# EAGLE design analog-devices (EAGLE 7.6.0)
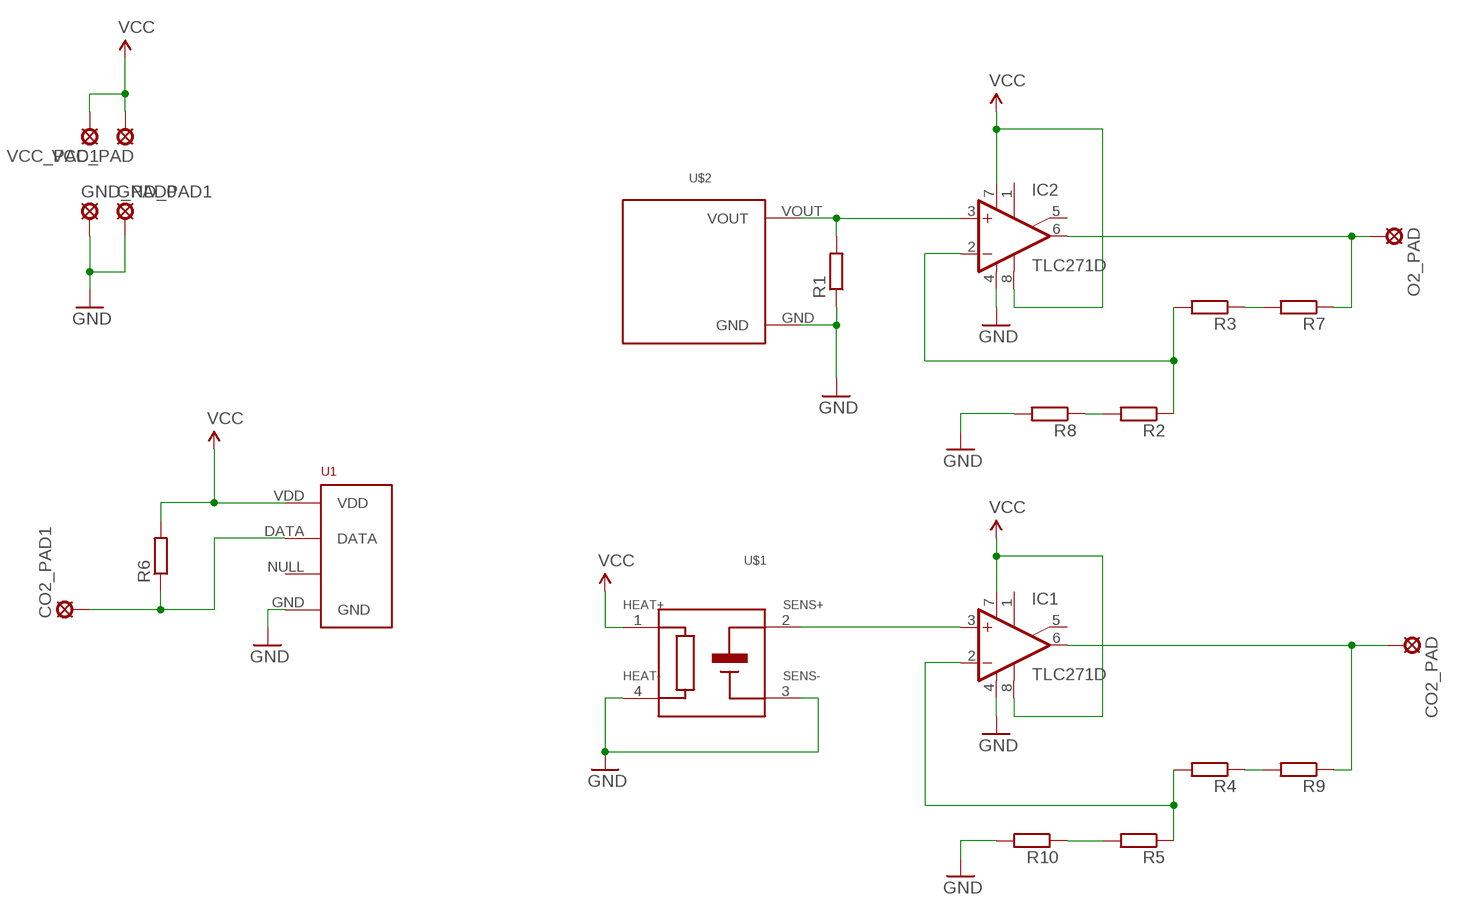
[diagram p0: schematic, sheet 1]

## Parts
CO2_PAD  LSP10  [LSP10]
CO2_PAD1  LSP10  [LSP10]
GND_PAD0  LSP10  [LSP10]
GND_PAD1  LSP10  [LSP10]
IC1  TLC271D  [SO08]
IC2  TLC271D  [SO08]
O2_PAD  LSP10  [LSP10]
R1  R-EU_R0805  [R0805]
R2  R-EU_R0805  [R0805]
R3  R-EU_R0805  [R0805]
R4  R-EU_R0805  [R0805]
R5  R-EU_R0805  [R0805]
R6  R-EU_R0805  [R0805]
R7  R-EU_R0805  [R0805]
R8  R-EU_R0805  [R0805]
R9  R-EU_R0805  [R0805]
R10  R-EU_R0805  [R0805]
U1  RHT03_DHT-22_AM2302RA  [RHT03_DHT-22/RA]
U$1  TGS4161  [TGS4161]
U$2  O2-A2  [O2-A2]
VCC_PAD  LSP10  [LSP10]
VCC_PAD1  LSP10  [LSP10]

## Nets
GND: GND_PAD0.MP GND_PAD1.MP IC1.4(V-) IC2.4(V-) R1.1 R8.2 R10.2 U1.GND U$1.3(SENS-) U$1.4(HEAT-) U$2.GND
N$1: IC2.3(+IN) R1.2 U$2.VOUT
N$2: CO2_PAD1.MP R6.1 U1.DATA
N$3: IC2.2(-IN) R2.1 R3.2
N$4: IC2.6(OUT) O2_PAD.MP R7.1
N$5: IC1.3(+IN) U$1.2(SENS+)
N$6: CO2_PAD.MP IC1.6(OUT) R9.1
N$7: R3.1 R7.2
N$8: R2.2 R8.1
N$10: R4.1 R9.2
N$11: R5.2 R10.1
N$13: IC1.2(-IN) R4.2 R5.1
VCC: IC1.7(V+) IC1.8(OPT) IC2.7(V+) IC2.8(OPT) R6.2 U1.VDD U$1.1(HEAT+) VCC_PAD1.MP VCC_PAD.MP
Unconnected: IC1.1(ON1) IC1.5(ON2) IC2.1(ON1) IC2.5(ON2) U1.NULL

## Library data of the parts
CO2_PAD CO2_PAD1 GND_PAD0 GND_PAD1 O2_PAD VCC_PAD VCC_PAD1 = solpad:LSP10: SOLDER PAD drill 1.0 mm, distributor Buerklin, 12H555
IC1 IC2 = linear:TLC271: OP AMP
R1-R10 = resistor:R-EU_: RESISTOR, European symbol
U1 = RHT03_DHT-22_AM2302:RHT03_DHT-22_AM2302: RHT03 / DHT-22 / AM2302 Packages and symbol for the RHT03 / DHT-22 relative humidity and temperature sensor. Note: The AM2302 is a wired version of the DHT-22 which typically requires less clearance and is thus provided as a separate package.; PROD_ID: SEN-10167
U$1 = datchiki:TGS4161: TGS4161 The Figaro TGS4161 is a new solid electrolyte type sensor which offers miniaturization, low power consumption, and long life. The TGS4161 displays high selectivity to carbon dioxide. Also, the TGS4161 displays good long term stability and shows excellent durability against the effects of high humidity through the application of innovative technology in the sensor’s electrode design. http://www.netzmafia.de/skripten/hardware/Datenblaetter/Gassensoren/TGS4161Dtl.pdf
U$2 = datchiki:O2-A2: O2-A2 Oxy O2-A2 Oxygen Sensor en Sensor http://www.alphasense.com/WEB1213/wp-content/uploads/2015/09/O2A2.pdf

## Board
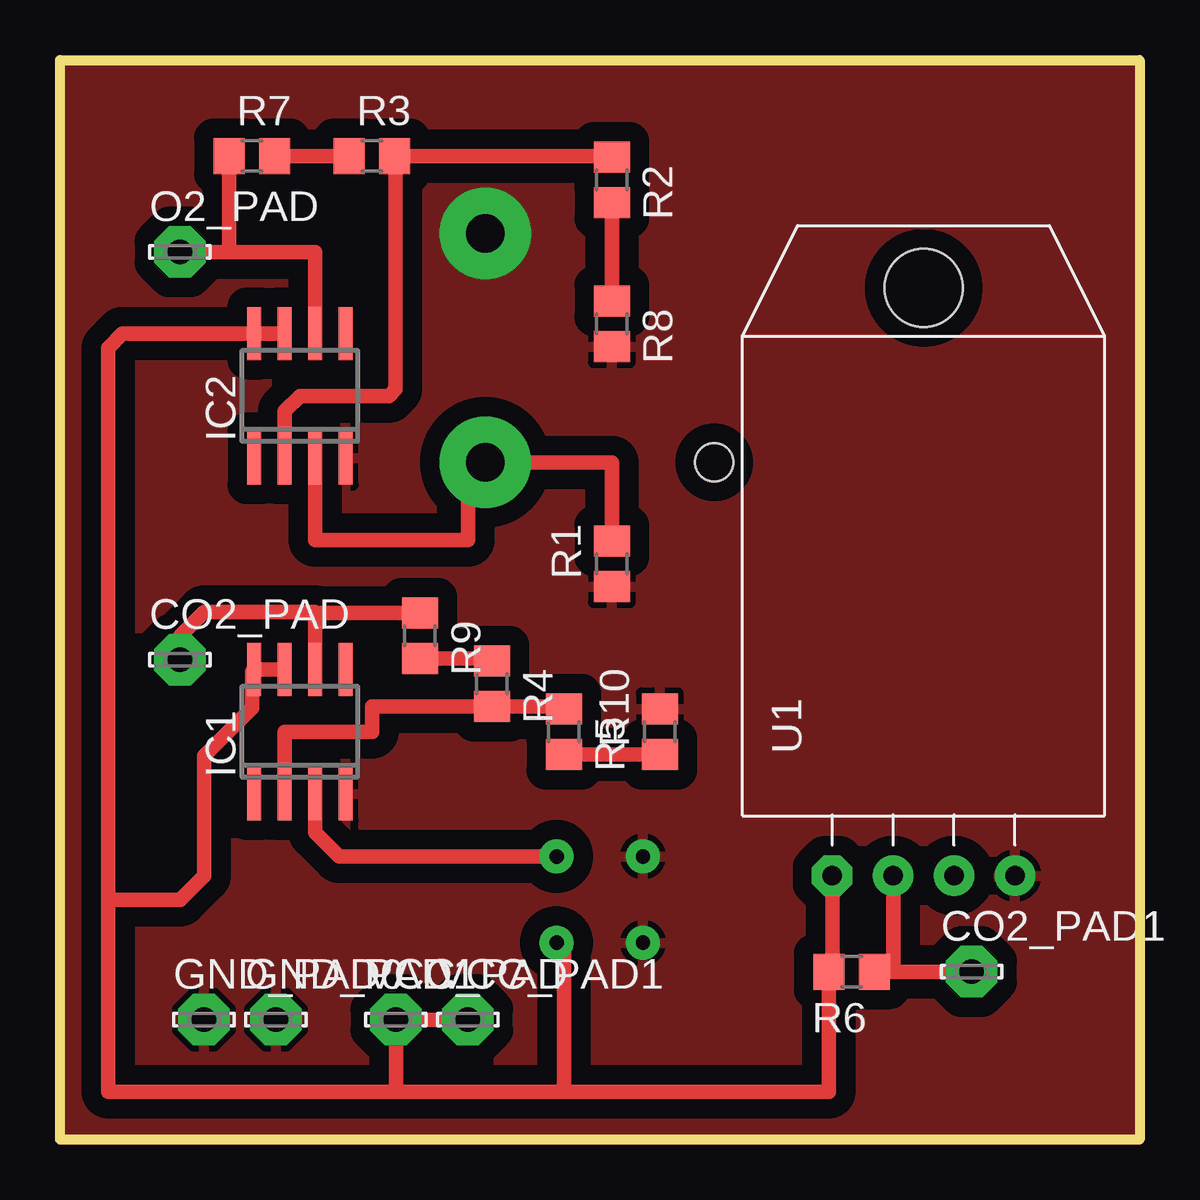
[diagram p1: board, top side]
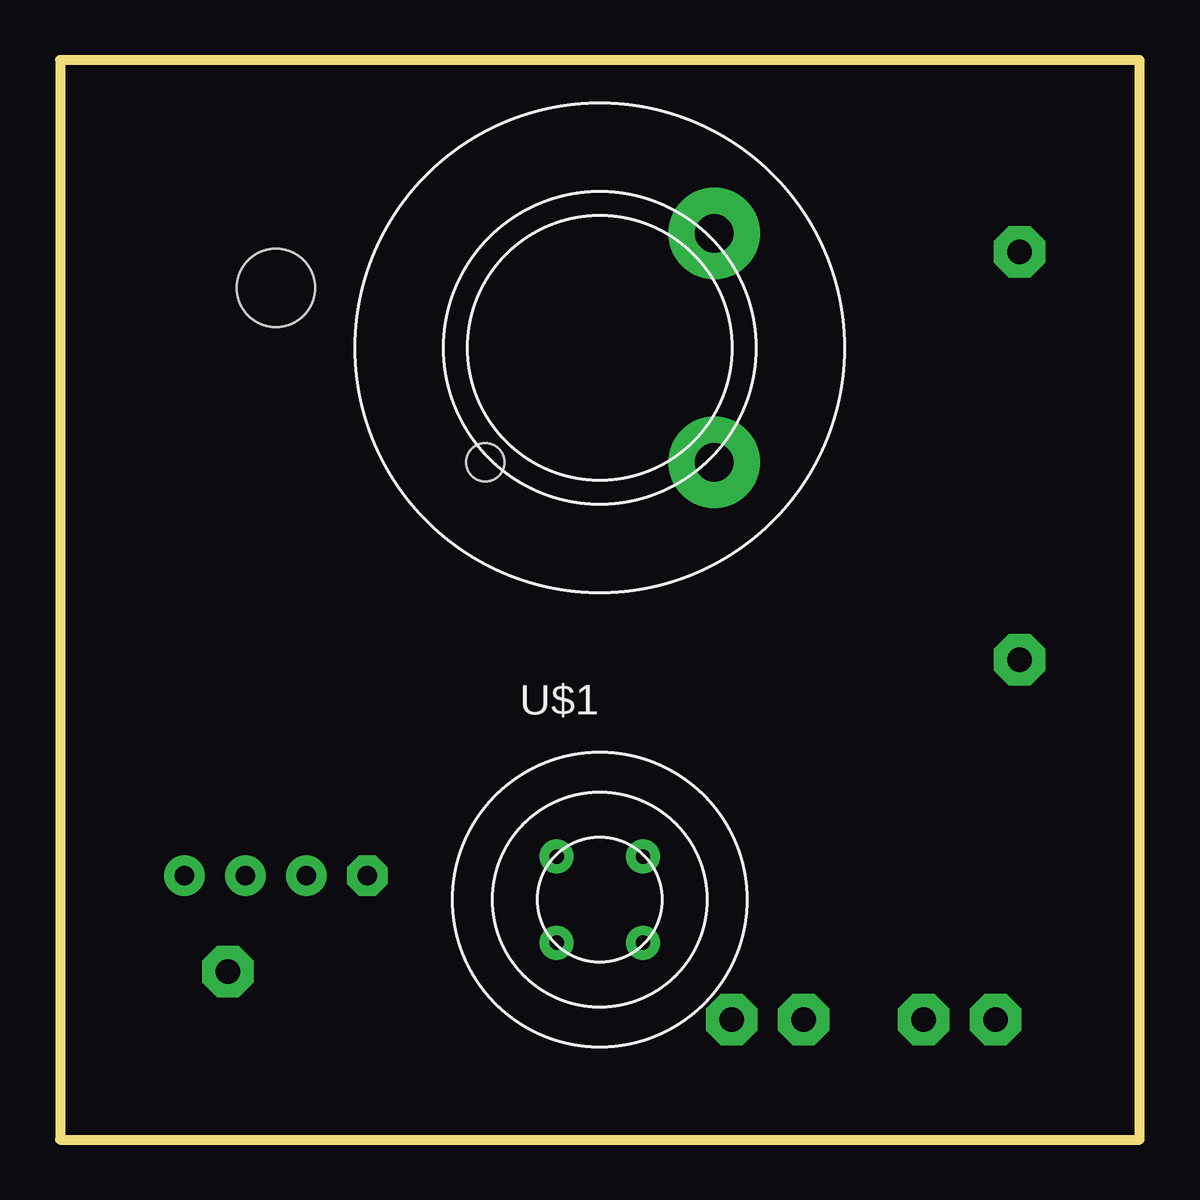
[diagram p2: board, bottom side, seen from below]

Size 45 x 45 mm. Coordinates in mm from the lower left corner, seen from the top.
Outline: 0,0 0,45 45,45 45,0 0,0
Copper layers (1*16): Top 0.035mm / dielectric 1.5mm / Bottom 0.035mm
Design rules "default *": minimum track width 10mil, minimum drill 24mil, track to track 8mil, track to pad 8mil, pad to pad 8mil, via to via 8mil, smd to smd 8mil, copper to edge 0mil, drill to drill 8mil, minimum pad ring 10mil, minimum via ring 8mil, stop-mask expansion 4mil, vias tented up to drill 0mil, thermal gap 10mil

### Footprints (pad centres in the part's own frame; a part is rotated, then mirrored left to right if it is on the bottom)
LSP10 = drill 1.016 pad 2.159 octagon: MP 0,0
SO08 = smd 0.6 x 2.2: 1 -1.905,-2.6; 2 -0.635,-2.6; 3 0.635,-2.6; 4 1.905,-2.6; 5 1.905,2.6; 6 0.635,2.6; 7 -0.635,2.6; 8 -1.905,2.6
R0805 = smd 1.3 x 1.5: 1 -0.95,0; 2 0.95,0
RHT03_DHT-22/RA = drill 0.8 pad 1.676: DATA -1.27,0; GND 3.81,0; NULL 1.27,0 | drill 0.8 pad 1.676 octagon: VDD -3.81,0 | hole 3.25: 0,24.5
TGS4161 = drill 0.6 pad 1.422: 1 1.8,-1.8; 2 1.8,1.8; 3 -1.8,1.8; 4 -1.8,-1.8
O2-A2 = drill 1.6 pad 3.81: GND 6.75,0; VOUT 0,-6.75 | hole 1.6: -6.75,0

### Placement (x,y rotation side)
CO2_PAD  5,20 0 top
CO2_PAD1  38,7 0 top
GND_PAD0  6,5 0 top
GND_PAD1  9,5 0 top
IC1  10,17 0 top
IC2  10,31 0 top
O2_PAD  5,37 0 top
R1  23,24 90 top
R2  23,40 270 top
R3  13,41 0 top
R4  18,19 270 top
R5  21,17 270 top
R6  33,7 180 top
R7  8,41 0 top
R8  23,34 270 top
R9  15,21 270 top
R10  25,17 90 top
U1  36,11 0 top
U$1  22.5,10 0 bottom
U$2  22.5,33 45 bottom
VCC_PAD  14,5 0 top
VCC_PAD1  17,5 0 top

### Tracks (layer width: path | path; a pad name or v marks a point on that pad's centre or on a via)
GND
  pour Top (isolate 0.813): 0,45 0,0 45,0 45,45
N$1
  Top 0.61: R1.2 23,28.23 U$2.VOUT 17,28.23 17,25 10.63,25 IC2.3
N$2
  Top 0.61: 34.73,7 U1.DATA | R6.1 34.73,7 | 34.73,7 CO2_PAD1.MP
N$3
  Top 0.61: IC2.2 9.37,30.36 10,31 13.72,31 13.99,31.28 13.99,41 R3.2 23,41 R2.1
N$4
  Top 0.61: IC2.6 10.63,37 O2_PAD.MP 7.05,37 R7.1
N$5
  Top 0.61: U$1.2 11.63,11.8 10.63,12.8 IC1.3
N$6
  Top 0.61: CO2_PAD.MP 5,21 6,22 10.63,22 10.63,21.95 | 10.63,21.95 IC1.6 | R9.1 10.63,21.95
N$7
  Top 0.61: R7.2 R3.1
N$8
  Top 0.61: R2.2 R8.1
N$10
  Top 0.61: R9.2 18,20.05 R4.1
N$11
  Top 0.61: R5.2 R10.1
N$13
  Top 0.61: R5.1 21,18.05 R4.2 13,18.05 13,17 9.37,17 IC1.2
VCC
  Top 0.406: U$1.1 21,8.2
  Top 0.61: IC1.7 IC1.8 8,19.5 8,18 6,16 6,11 5,10 2,10 | IC2.7 IC2.8 2.6,33.6 2,33 2,10 | 14,2 VCC_PAD.MP VCC_PAD1.MP | 21,2 14,2 | 14,2 2,2 2,10 | 21,8.2 21,2 | 21,2 32.05,2 R6.2 32.19,7 U1.VDD